# Altium schematic sheet USB_PD_IC.SchDoc
size 420 x 297 mm; SheetNumber: 1; SheetTotal: 2
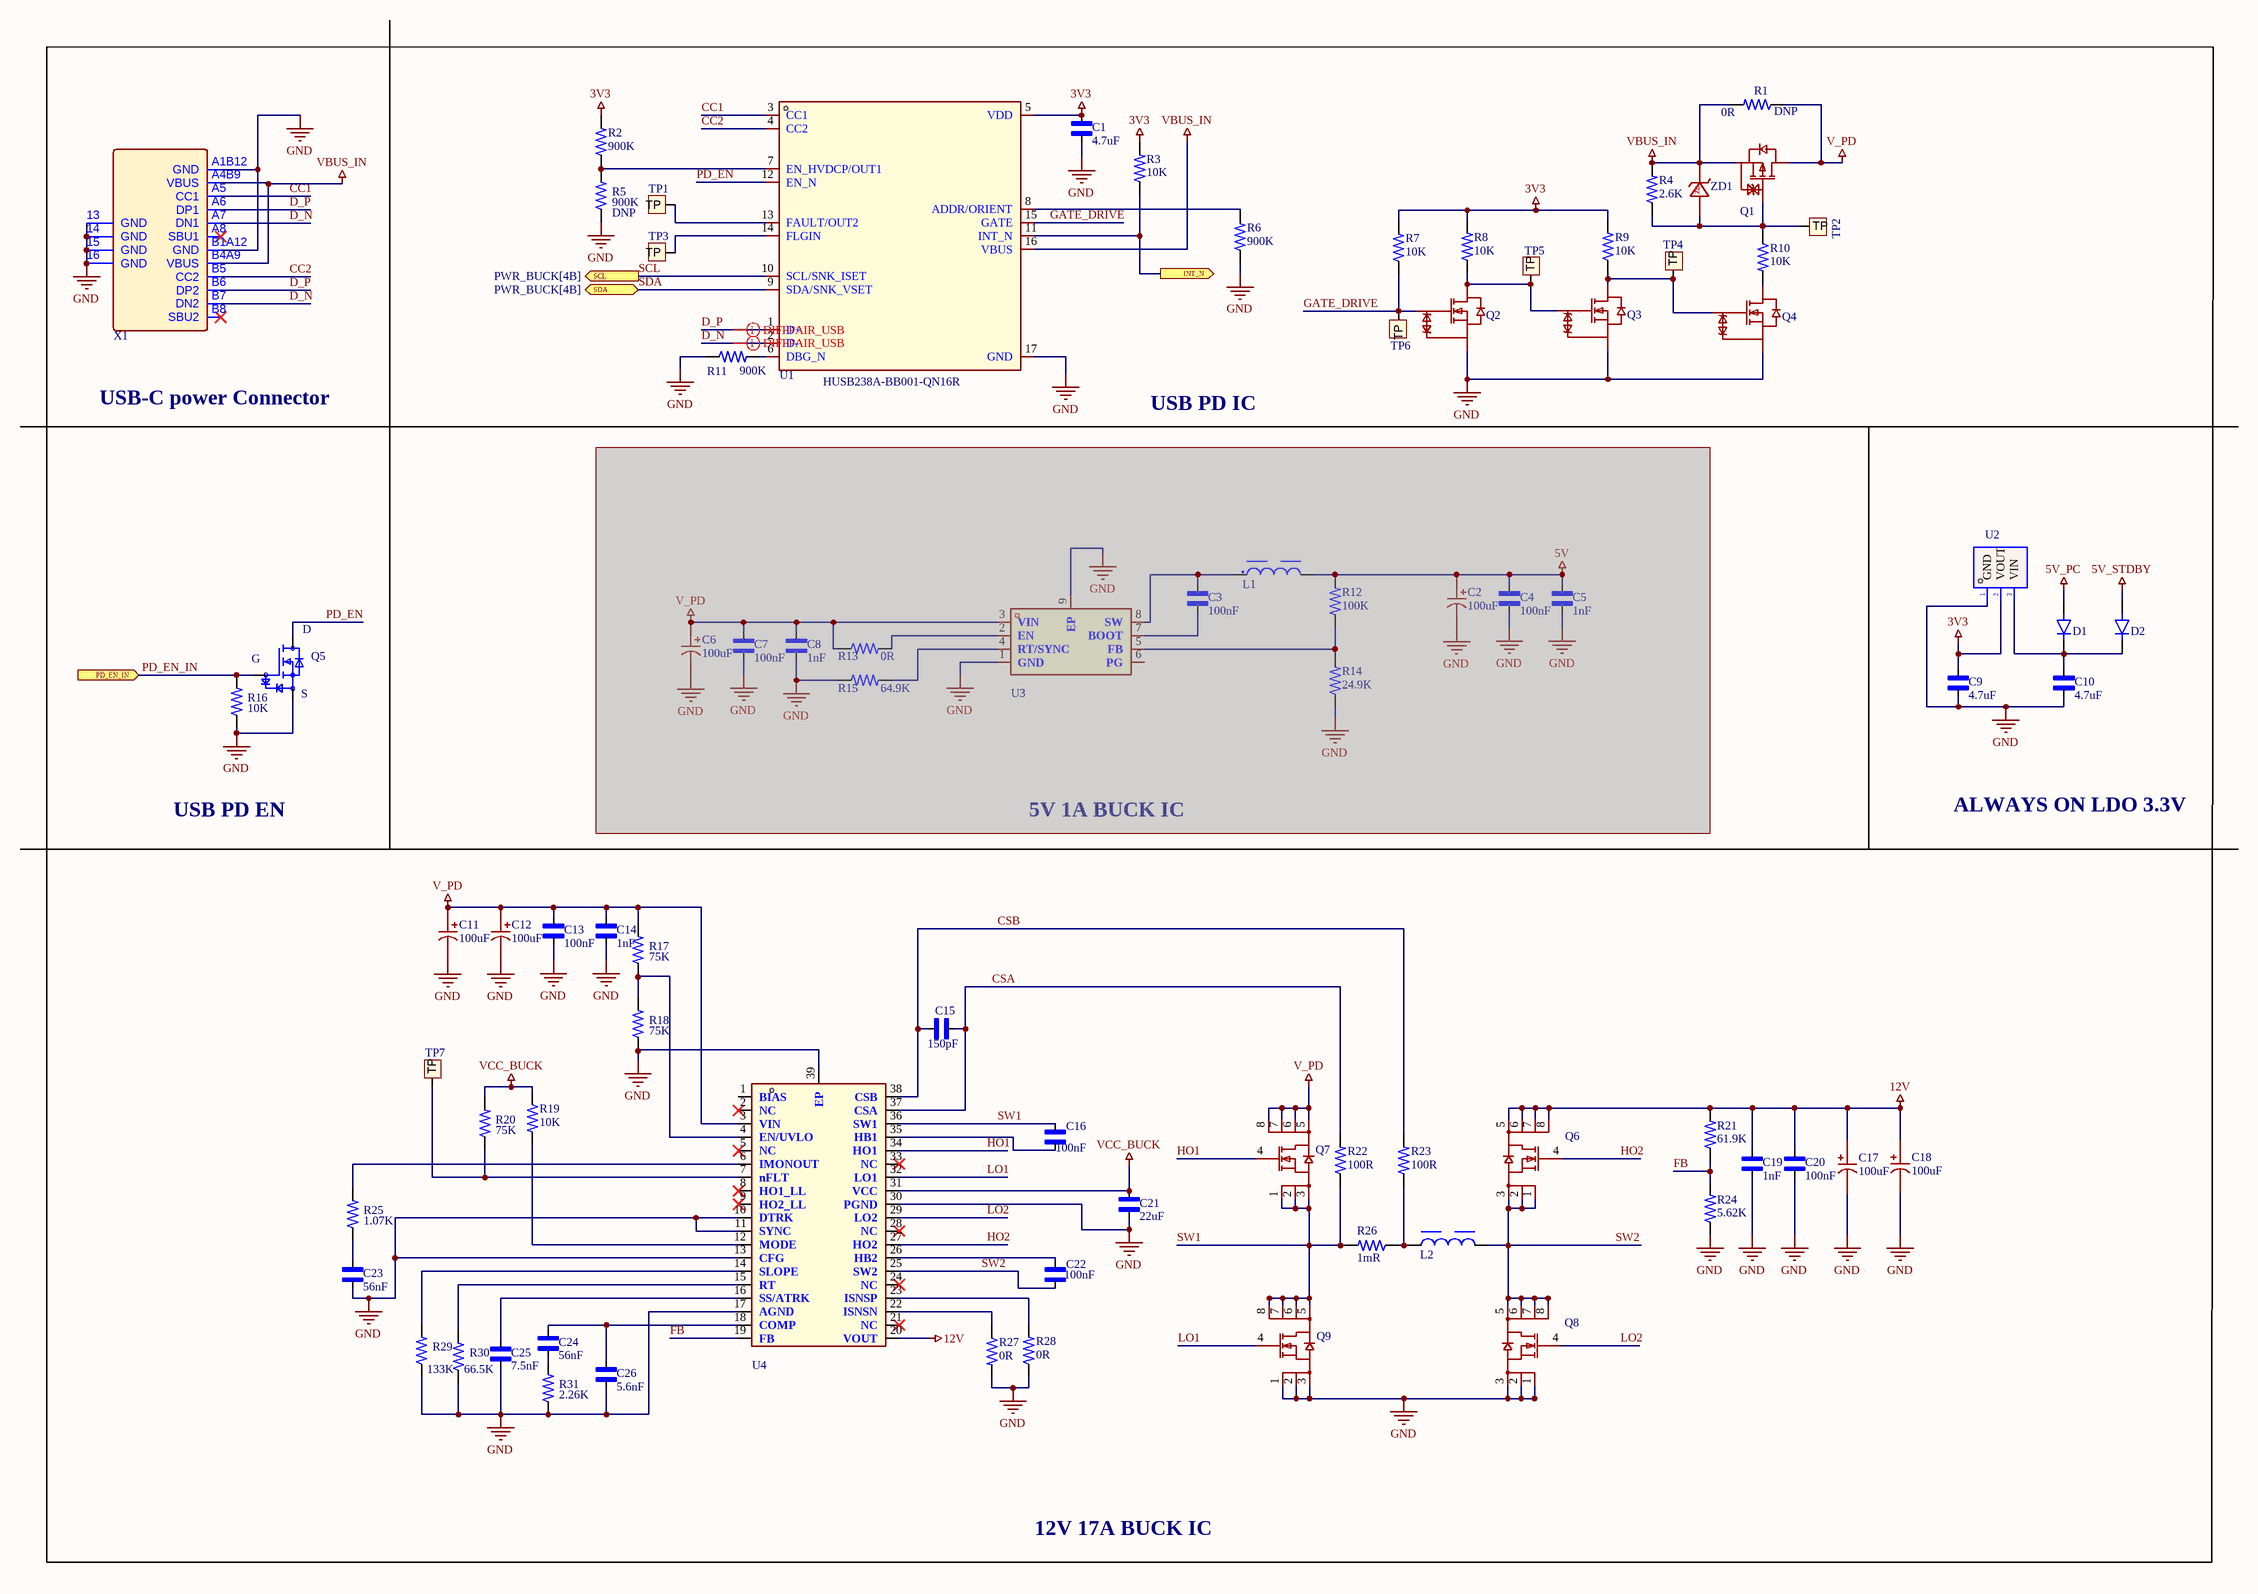
[diagram p0: USB_PD_IC.SchDoc]

## Parts
C1  value 4.7uF  [CAP_0603]  (hidden comment: SMD capacitor)
C2  value 100uF  [CAP-SMD_BD10.0-L10.3-W10.3-LS11.0-FD]  (hidden comment: SMD capacitor)  (masked out: inside a compile mask, not in the netlist)
C3  value 100nF  [CAP_0603]  (hidden comment: SMD capacitor)  (masked out: inside a compile mask, not in the netlist)
C4  value 100nF  [CAP_0603]  (hidden comment: SMD capacitor)  (masked out: inside a compile mask, not in the netlist)
C5  value 1nF  [CAP_0603]  (hidden comment: SMD capacitor)  (masked out: inside a compile mask, not in the netlist)
C6  value 100uF  [CAP-SMD_BD10.0-L10.3-W10.3-LS11.0-FD]  (hidden comment: SMD capacitor)  (masked out: inside a compile mask, not in the netlist)
C7  value 100nF  [CAP_0603]  (hidden comment: SMD capacitor)  (masked out: inside a compile mask, not in the netlist)
C8  value 1nF  [CAP_0603]  (hidden comment: SMD capacitor)  (masked out: inside a compile mask, not in the netlist)
C9  value 4.7uF  [CAP_0603]  (hidden comment: SMD capacitor)
C10  value 4.7uF  [CAP_0603]  (hidden comment: SMD capacitor)
C11  value 100uF  [CAP-SMD_BD10.0-L10.3-W10.3-LS11.0-FD]  (hidden comment: SMD capacitor)
C12  value 100uF  [CAP-SMD_BD10.0-L10.3-W10.3-LS11.0-FD]  (hidden comment: SMD capacitor)
C13  value 100nF  [CAP_0603]  (hidden comment: SMD capacitor)
C14  value 1nF  [CAP_0603]  (hidden comment: SMD capacitor)
C15  value 150pF  [CAP_0603]  (hidden comment: SMD capacitor)
C16  value 100nF  [CAP_0603]  (hidden comment: SMD capacitor)
C17  value 100uF  [CAP-SMD_BD10.0-L10.3-W10.3-LS11.0-FD]  (hidden comment: SMD capacitor)
C18  value 100uF  [CAP-SMD_BD10.0-L10.3-W10.3-LS11.0-FD]  (hidden comment: SMD capacitor)
C19  value 1nF  [CAP_0603]  (hidden comment: SMD capacitor)
C20  value 100nF  [CAP_0603]  (hidden comment: SMD capacitor)
C21  value 22uF  [CAP_0805]  (hidden comment: SMD capacitor)
C22  value 100nF  [CAP_0603]  (hidden comment: SMD capacitor)
C23  value 56nF  [CAP_0603]  (hidden comment: SMD capacitor)
C24  value 56nF  [CAP_0603]  (hidden comment: SMD capacitor)
C25  value 7.5nF  [CAP_0603]  (hidden comment: SMD capacitor)
C26  value 5.6nF  [CAP_0603]  (hidden comment: SMD capacitor)
D1  Diode  [SS54   SMA(DO-214AC)]  (value not drawn)
D2  Diode  [SS54   SMA(DO-214AC)]  (value not drawn)
L1  FIXED IND  [WE-PD_7345P]  (value not drawn)  (masked out: inside a compile mask, not in the netlist)
L2  FIXED IND  [WE-HCI_1890]  (value not drawn)
Q1  MOSFET P-CH 60V 60A DPAK  [TO-252-2_L6.6-W5.6-P4.60-LS9.7-BR]  (value not drawn)
Q2  MOSFET N-CH 60V 380mA SOT-23  [SOT-23-3_L2.9-W1.3-P1.90-LS2.4-BR]  (value not drawn)
Q3  MOSFET N-CH 60V 380mA SOT-23  [SOT-23-3_L2.9-W1.3-P1.90-LS2.4-BR]  (value not drawn)
Q4  MOSFET N-CH 60V 380mA SOT-23  [SOT-23-3_L2.9-W1.3-P1.90-LS2.4-BR]  (value not drawn)
Q5  MOSFET N-CH 30V 350mA  [SOT65P210X110-3N]  (value not drawn)
Q6  MOSFET N-CH  [POWERPAK-SO-8_L5.9-W4.9-P1.27-LS6.2-BL]  (value not drawn)
Q7  MOSFET N-CH  [POWERPAK-SO-8_L5.9-W4.9-P1.27-LS6.2-BL]  (value not drawn)
Q8  MOSFET N-CH  [POWERPAK-SO-8_L5.9-W4.9-P1.27-LS6.2-BL]  (value not drawn)
Q9  MOSFET N-CH  [POWERPAK-SO-8_L5.9-W4.9-P1.27-LS6.2-BL]  (value not drawn)
R1  DNP  value 0R  [RES_2512]
R2  value 900K  [RES_0603]  (hidden comment: SMD resistor)
R3  value 10K  [RES_0603]  (hidden comment: SMD resistor)
R4  value 2.6K  [RES_0603]  (hidden comment: SMD resistor)
R5  DNP  value 900K  [RES_0603]
R6  value 900K  [RES_0603]  (hidden comment: SMD resistor)
R7  value 10K  [RES_0603]  (hidden comment: SMD resistor)
R8  value 10K  [RES_0603]  (hidden comment: SMD resistor)
R9  value 10K  [RES_0603]  (hidden comment: SMD resistor)
R10  value 10K  [RES_0603]  (hidden comment: SMD resistor)
R11  value 900K  [RES_0603]  (hidden comment: SMD resistor)
R12  value 100K  [RES 0402]  (hidden comment: SMD Resistor)  (masked out: inside a compile mask, not in the netlist)
R13  value 0R  [RES 0402]  (hidden comment: SMD Resistor)  (masked out: inside a compile mask, not in the netlist)
R14  value 24.9K  [RES 0402]  (hidden comment: SMD Resistor)  (masked out: inside a compile mask, not in the netlist)
R15  value 64.9K  [RES 0402]  (hidden comment: SMD Resistor)  (masked out: inside a compile mask, not in the netlist)
R16  value 10K  [RES_0603]  (hidden comment: SMD Resistor)
R17  value 75K  [RES_0603]  (hidden comment: SMD Resistor)
R18  value 75K  [RES_0603]  (hidden comment: SMD Resistor)
R19  value 10K  [RES_0603]  (hidden comment: SMD Resistor)
R20  value 75K  [RES_0603]  (hidden comment: SMD Resistor)
R21  value 61.9K  [RES_0603]  (hidden comment: SMD Resistor)
R22  value 100R  [RES_0603]  (hidden comment: SMD Resistor)
R23  value 100R  [RES_0603]  (hidden comment: SMD Resistor)
R24  value 5.62K  [RES_0603]  (hidden comment: SMD Resistor)
R25  value 1.07K  [RES_0603]  (hidden comment: SMD Resistor)
R26  value 1mR  [RES_2512]  (hidden comment: SMD Resistor)
R27  value 0R  [RES 0402]  (hidden comment: SMD Resistor)
R28  value 0R  [RES 0402]  (hidden comment: SMD Resistor)
R29  value 133K  [RES_0603]  (hidden comment: SMD Resistor)
R30  value 66.5K  [RES_0603]  (hidden comment: SMD Resistor)
R31  value 2.26K  [RES_0603]  (hidden comment: SMD Resistor)
TP1  TEST POINT  [TESTPOINT]  (value not drawn)
TP2  TEST POINT  [TESTPOINT]  (value not drawn)
TP3  TEST POINT  [TESTPOINT]  (value not drawn)
TP4  TEST POINT  [TESTPOINT]  (value not drawn)
TP5  TEST POINT  [TESTPOINT]  (value not drawn)
TP6  TEST POINT  [TESTPOINT]  (value not drawn)
TP7  TEST POINT  [TESTPOINT]  (value not drawn)
U1  Manifacturing Part Number: HUSB238A-BB001-QN16R  [QFN-16_L3.0-W3.0-P0.50-BL-EP1.7]  (hidden comment: USB-PD-IC)
U2  3.3V LDO  [SOT-89-3_L4.5-W2.5-P1.50-LS4.1-BR]  (value not drawn)
U3  Buck IC  [ESOP-8_L4.9-W3.9-P1.27-LS6.0-BL-EP-1]  (value not drawn)  (masked out: inside a compile mask, not in the netlist)
U4  Buck IC  [HTSSOP-38_L9.7-W4.4-P0.50-LS6.4-BL-EP]  (value not drawn)
X1  USB-C connector  [USB-C-SMD_TYPEC-304J-BCP16]  (value not drawn)
ZD1  DIODE ZENER 10V 5W SMB  [SMB_L4.3-W3.6-LS5.2-RD]  (value not drawn)

## Ports
INT_N (out, see PWR_BUCK[4B]), PD_EN_IN (in, see PWR_BUCK[1C]), SCL (out, see PWR_BUCK[4B]), SDA (bidir, see PWR_BUCK[4B])

## Nets
3V3: C1.1 C9.1 R2.2 R3.2 R7.2 R8.2 R9.2 U1.5(VDD) U2.2(VOUT)
5V_PC: D1.2(A)
5V_STDBY: D2.2(A)
12V: C17.1 C18.1 C19.1 C20.1 Q6.5(D) Q6.6(D) Q6.7(D) Q6.8(D) R21.2 U4.20(VOUT)
GND: C1.2 C9.2 C10.2 C11.2 C12.2 C13.2 C14.2 C17.2 C18.2 C19.2 C20.2 C21.2 C23.2 C25.2 C26.2 Q2.2(S) Q3.2(S) Q4.2(S) Q5.2(S) Q8.1(S) Q8.2(S) Q8.3(S) Q9.1(S) Q9.2(S) Q9.3(S) R5.1 R6.1 R11.1 R16.1 R18.1 R24.1 R27.2 R28.1 R29.1 R30.1 R31.1 U1.17(GND) U2.1(GND) U4.10(DTRK) U4.11(SYNC) U4.13(CFG) U4.17(AGND) U4.30(PGND) U4.39(EP) X1.13(GND) X1.14(GND) X1.15(GND) X1.16(GND) X1.A1B12(GND) X1.B1A12(GND)
V_PD: C11.1 C12.1 C13.1 C14.1 Q1.2(D) Q7.5(D) Q7.6(D) Q7.7(D) Q7.8(D) R1.1 R17.2 U4.3(VIN)
VBUS_IN: Q1.3(S) R1.2 R4.2 U1.16(VBUS) X1.A4B9(VBUS) X1.B4A9(VBUS) ZD1.1(K)
VCC_BUCK: C21.1 R19.1 R20.2 U4.31(VCC)
CC1: U1.3(CC1) X1.A5(CC1)
CC2: U1.4(CC2) X1.B5(CC2)
CSA: C15.2 R22.2 U4.37(CSA)
CSB: C15.1 R23.2 U4.38(CSB)
D_N: U1.2(D-) X1.A7(DN1) X1.B7(DN2)
D_P: U1.1(D+) X1.A6(DP1) X1.B6(DP2)
FB: R21.1 R24.2 U4.19(FB)
GATE_DRIVE: Q2.1(G) R7.1 TP6.1(TP) U1.15(GATE)
HO1: Q7.4(G) U4.34(HO1)
HO2: Q6.4(G) U4.27(HO2)
INT_N: R3.1 U1.11(INT_N) ; port INT_N
LO1: Q9.4(G) U4.32(LO1)
LO2: Q8.4(G) U4.29(LO2)
PD_EN: Q5.3(D) U1.12(EN_N)
PD_EN_IN: Q5.1(G) R16.2 ; port PD_EN_IN
SCL: U1.10(SCL/SNK_ISET) ; port SCL
SDA: U1.9(SDA/SNK_VSET) ; port SDA
SW1: C16.2 Q7.1(S) Q7.2(S) Q7.3(S) Q9.5(D) Q9.6(D) Q9.7(D) Q9.8(D) R22.1 R26.2 U4.36(SW1)
SW2: C22.1 L2.2 Q6.1(S) Q6.2(S) Q6.3(S) Q8.5(D) Q8.6(D) Q8.7(D) Q8.8(D) U4.25(SW2)
NetC10_1: C10.1 D1.1(K) D2.1(K) U2.3(VIN)
NetC16_1: C16.1 U4.35(HB1)
NetC22_2: C22.2 U4.26(HB2)
NetC23_1: C23.1 R25.1
NetC24_1: C24.1 C26.1 U4.18(COMP)
NetC24_2: C24.2 R31.2
NetC25_1: C25.1 U4.16(SS/ATRK)
NetL2_1: L2.1 R23.1 R26.1
NetQ1_1: Q1.1(G) R4.1 R10.1 TP2.1(TP) ZD1.2(A)
NetQ2_3: Q2.3(D) Q3.1(G) R8.1 TP5.1(TP)
NetQ3_3: Q3.3(D) Q4.1(G) R9.1 TP4.1(TP)
NetQ4_3: Q4.3(D) R10.2
NetR2_1: R2.1 R5.2 U1.7(EN_HVDCP/OUT1)
NetR6_2: R6.2 U1.8(ADDR/ORIENT)
NetR11_2: R11.2 U1.6(DBG_N)
NetR17_1: R17.1 R18.2 U4.4(EN/UVLO)
NetR19_2: R19.2 U4.12(MODE)
NetR20_1: R20.1 TP7.1(TP) U4.7(nFLT)
NetR25_2: R25.2 U4.6(IMONOUT)
NetR27_1: R27.1 U4.22(ISNSN)
NetR28_2: R28.2 U4.23(ISNSP)
NetR29_2: R29.2 U4.14(SLOPE)
NetR30_2: R30.2 U4.15(RT)
NetTP1_1: TP1.1(TP) U1.13(FAULT/OUT2)
NetTP3_1: TP3.1(TP) U1.14(FLGIN)

Not connected (* = marked no-connect by the designer): U4 1(BIAS) 2(NC)* 5(NC)* 8(HO1_LL)* 9(HO2_LL)* 21(NC)* 24(NC)* 28(NC)* 33(NC)*; X1 A8(SBU1)* B8(SBU2)*

## Layout directives
differential pair; differential pair class USB: D_N, D_P

## Notes on the sheet
- USB-C power Connector
- USB PD IC
- USB PD EN
- 5V 1A BUCK IC
- ALWAYS ON LDO 3.3V
- 12V 17A BUCK IC
- (in symbol SMBJ5347B) ZD

## Library data of the parts
C1 C3-C5 C7-C10 C13-C16 C19 C20 C22-C26 = CAP_SMD_CERAMIC: Tolerance: ±10%; Package: 0603; Price: *; Voltage: *; JLCPCB Part #: *
C2 C6 C11 C12 C17 C18 = 63SXV100M: 63V 100uF Polymer ±20% 25mΩ 164mA@120Hz SMD,D10xL12.7mm Aluminum - Polymer Capacitors ROHS; Manifacturing Company Name: PANASONIC; Manifacturing Part Number: 63SXV100M; Data Sheet: https://www.lcsc.com/datasheet/C3274502.pdf; Package: SMD,D10xL12.7mm; Price: *; Voltage: 63V; Tolerance: ±20%; JLCPCB Part #: *
C21 = CAP_SMD_CERAMIC: Voltage: 35V; Tolerance: ±10%; Package: 0805; Price: *; JLCPCB Part #: *
D1 D2 = SS54: 40V 550mV@5A 5A SMA(DO-214AC) Schottky Barrier Diodes (SBD) ROHS; Manifacturing Company Name: FUXINSEMI; Manifacturing Part Number: SS54; Data Sheet: https://datasheet.lcsc.com/lcsc/2205301745_FUXINSEMI-SS54_C3018536.pdf; Package: SMA(DO-214AC); Price: *
L1 = 7447773150: 15 µH Shielded Drum Core, Wirewound Inductor 2.2 A 69.5mOhm Max Nonstandard; Manifacturing Company Name: Würth Elektronik; Manifacturing Part Number: 7447773150; Data Sheet: https://www.we-online.com/components/products/datasheet/7447773150.pdf; Package: SMD,0.291" L x 0.287" W (7.40mm x 7.30mm); Price: *; Tolerance: N/A
L2 = 7443556130: 1.3 µH Shielded Wirewound Inductor 34.5 A 0.94mOhm Nonstandard; Manifacturing Company Name: Würth Elektronik; Manifacturing Part Number: 7443556130; Data Sheet: https://www.we-online.com/components/products/datasheet/7443556130.pdf; Package: 0.720" L x 0.717" W (18.30mm x 18.20mm); Price: *
Q1 = TJ60S06M3L(T6L1,NQ): 60V 60A 100W 8.6mΩ@10V 1 P-Channel DPAK Single FETs, MOSFETs ROHS; Manifacturing Company Name: TOSHIBA; Manifacturing Part Number: TJ60S06M3L(T6L1,NQ; Data Sheet: https://www.lcsc.com/datasheet/C7068953.pdf; Package: C7068953; Price: *; Tolerance: N/A; JLCPCB Part #: C2835315
Q2-Q4 = 2N7002KT1G: 60V 380mA 2.5Ω@4.5V,200mA 420mW 2.3V@250uA 1 N-Channel SOT-23 Single FETs, MOSFETs ROHS; Manifacturing Company Name: onsemi; Manifacturing Part Number: 2N7002KT1G; Data Sheet: https://www.lcsc.com/datasheet/C116584.pdf; Package: SOT-23; Price: *; JLCPCB Part #: C116584
Q5 = NX3008NBKW,115: 30V 350mA 830mW 1.4Ω@4.5V 1.1V@250uA 1 N-Channel SC-70 MOSFETs ROHS; Manifacturing Company Name: Nexperia; Manifacturing Part Number: NX3008NBKW,115; Data Sheet: https://www.lcsc.com/datasheet/C282548.pdf; Package: SC-70; Price: *; JLCPCB Part #: C282548
Q6-Q9 = SIR180DP-T1-RE3: 60V 32.4A 53.3W 1.7mΩ@10V 3.6V 1 N-Channel PowerPAKSO-8 Single FETs, MOSFETs ROHS; Manifacturing Company Name: VISHAY; Manifacturing Part Number: SIR180DP-T1-RE3; Data Sheet: https://www.lcsc.com/datasheet/C3274502.pdf; Package: PowerPAKSO-8; Price: *; JLCPCB Part #: C5334421
R1 R5 = RES_SMD_CERAMIC: SMD Resistor; Tolerance: ±5%; Price: *; JLCPCB Part #: *
  R1: Package: 2512
  R5: Package: 0603
R2-R4 R6-R31 = RES_SMD_CERAMIC: Tolerance: ±5%; Price: *; JLCPCB Part #: *
  R2 R3 R6-R9 R11-R31: Package: 0603
  R4 R10: Package: 1206
U1 = Hynetek HUSB238A-BB001-QN16R: QFN-16L-EP(3x3) USB PD ROHS; Manifacturing Company Name: Hynetek; Data Sheet: https://www.lcsc.com/datasheet/C24833806.pdf; Package: QFN-16L-EP(3x3); Price: *; Tolerance: N/A; JLCPCB Part #: C24833806
U2 = AMS1117S-3.3: 70dB@(120Hz) 1A Fixed 3.3V Positive 30V SOT-89-3 Voltage Regulators - Linear, Low Drop Out (LDO) Regulators ROHS; Manifacturing Company Name: JSMSEMI; Manifacturing Part Number: AMS1117S-3.3; Data Sheet: https://www.lcsc.com/datasheet/C917152.pdf; Package: SOT-89-3; Price: *; Tolerance: N/A; JLCPCB Part #: JSMSEMI; Value: *
U3 = LMR38020SDDAR: 2.2MHz 2A Buck Adjustable 1V~75V 1 SOP-8-EP Voltage Regulators - DC DC Switching Regulators ROHS; Manifacturing Company Name: Texas Instruments; Manifacturing Part Number: LMR38020SDDAR; Data Sheet: https://www.lcsc.com/datasheet/C3192337.pdf; Package: SOP-8-EP; Price: *; Tolerance: N/A; JLCPCB Part #: C3192337
U4 = LM51770DCPR: Buck-Boost Regulator Positive Output Step-Up/Step-Down DC-DC Controller IC 38-HTSSOP; Manifacturing Company Name: TI; Manifacturing Part Number: LM51770DCPR; Data Sheet: https://www.ti.com.cn/cn/lit/ds/symlink/lm51770.pdf; Package: 38-HTSSOP; Price: *; Tolerance: N/A; JLCPCB Part #: C43351171
X1 = TYPEC-304J-BCP16: 5A USB 3.1 1 Surface Mount, Right Angle 16P Female -40℃~+85℃ Type-C SMD USB Connectors ROHS; Manifacturing Part Number: USB4105-GF-A; Manifacturing Company Name: GCT; Data Sheet: https://gct.co/files/specs/usb4105-spec.pdf; Package: SMD; Price: *; Tolerance: N/A; JLCPCB Part #: C2835315
ZD1 = SMBJ5347B: Independent 9.5V~10.5V 5W 10V SMB(DO-214AA) Single Zener Diodes ROHS; Manifacturing Company Name: LGE; Manifacturing Part Number: SMBJ5347B; Data Sheet: https://www.lcsc.com/datasheet/C2903873.pdf; Package: SMB(DO-214AA); Price: *; JLCPCB Part #: C2903873